# EAGLE design MotoraufsatzschSMD_V2.0 (EAGLE 5.03)
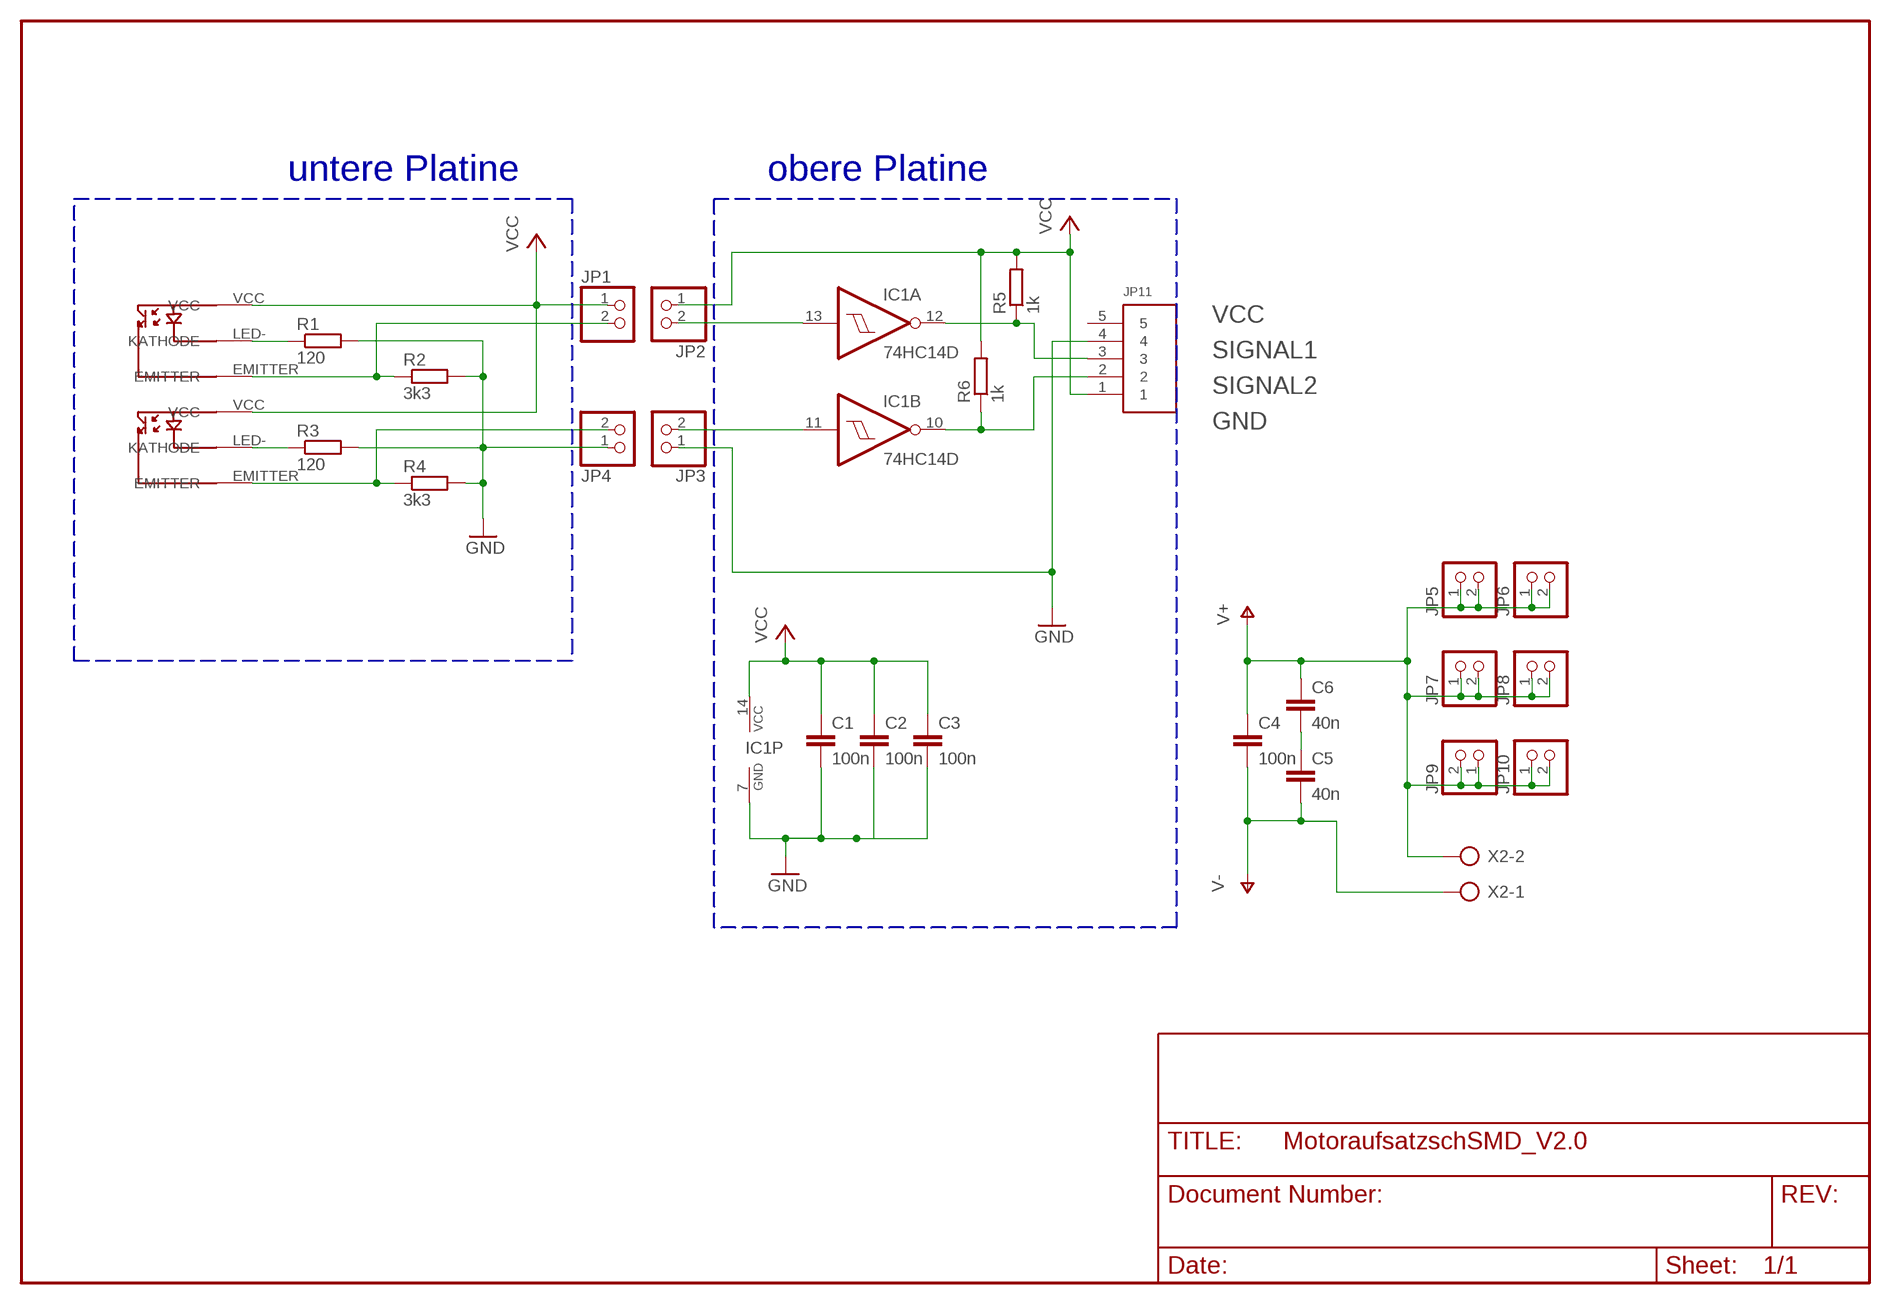
[diagram p0: schematic, sheet 1]

## Parts
C1  100n  C-EUC1206K  [C1206K]
C2  100n  C-EUC1206K  [C1206K]
C3  100n  C-EUC1206K  [C1206K]
C4  100n  C-EU050-024X044  [C050-024X044]
C5  40n  C-EU050-024X044  [C050-024X044]
C6  40n  C-EU050-024X044  [C050-024X044]
IC1  74HC14D  [SO14]
JP1  PINHD-1X2  [1X02]
JP2  PINHD-1X2  [1X02]
JP3  PINHD-1X2  [1X02]
JP4  PINHD-1X2  [1X02]
JP5  PINHD-1X2  [1X02]
JP6  PINHD-1X2  [1X02]
JP7  PINHD-1X2  [1X02]
JP8  PINHD-1X2  [1X02]
JP9  PINHD-1X2  [1X02]
JP10  PINHD-1X2  [1X02]
JP11  5PIN  [B5B-PH-K-S]
R1  120  R-EU_R0805  [R0805]
R2  3k3  R-EU_R0805  [R0805]
R3  120  R-EU_R0805  [R0805]
R4  3k3  R-EU_R0805  [R0805]
R5  1k  R-EU_R0805  [R0805]
R6  1k  R-EU_R0805  [R0805]
U$1  RPI-243-LED-V2  [RPI-243-LED2]
U$2  RPI-243-LED-V2  [RPI-243-LED2]
X2  AK500/2-H  [AK500/2-H]

## Nets
GND: C1.2 C2.2 C3.2 IC1.7(P:GND) JP3.1 JP4.1 JP11.4 R1.2 R2.2 R3.2 R4.2
N$1: C5.1 C6.2
N$3: R3.1 U$2.LED-(KATHODE)
N$4: JP1.2 R2.1 U$1.EMITTER
N$5: JP4.2 R4.1 U$2.EMITTER
N$6: R1.1 U$1.LED-(KATHODE)
N$10: IC1.11(B:I) JP3.2
N$11: IC1.13(A:I) JP2.2
SIGNAL1: IC1.12(A:O) JP11.3 R5.1
SIGNAL2: IC1.10(B:O) JP11.2 R6.1
V+: C4.1 C6.1 JP5.1 JP5.2 JP6.1 JP6.2 JP7.1 JP7.2 JP8.1 JP8.2 JP9.1 JP9.2 JP10.1 JP10.2 X2.2
V-: C4.2 C5.2 X2.1
VCC: C1.1 C2.1 C3.1 IC1.14(P:VCC) JP1.1 JP2.1 JP11.1 R5.2 R6.2 U$1.VCC U$2.VCC
Unconnected: IC1.1(D:I) IC1.2(D:O) IC1.3(E:I) IC1.4(E:O) IC1.5(F:I) IC1.6(F:O) IC1.8(C:O) IC1.9(C:I) JP11.5

## Buses
B$1
B$2

## Notes on the sheet
- untere Platine | obere Platine

## Library data of the parts
C1-C6 = rcl:C-EU: CAPACITOR, European symbol
IC1 = 74xx-eu:74*14: Hex schmitt trigger INVERTER
JP1-JP10 = pinhead:PINHD-1X2: PIN HEADER
JP11 = jst_eph:5PIN
R1-R6 = rcl:R-EU_: RESISTOR, European symbol
U$1 U$2 = olaf:RPI-243-LED-V2
X2 = con-ptr500:AK500/2-H: CONNECTOR Aug. 2004 / PTR Meßtechnik: Die Bezeichnung der Serie AK505 wurde geändert. Es handelt sich hierbei um AK500 in horizontaler Ausführung.

## Board
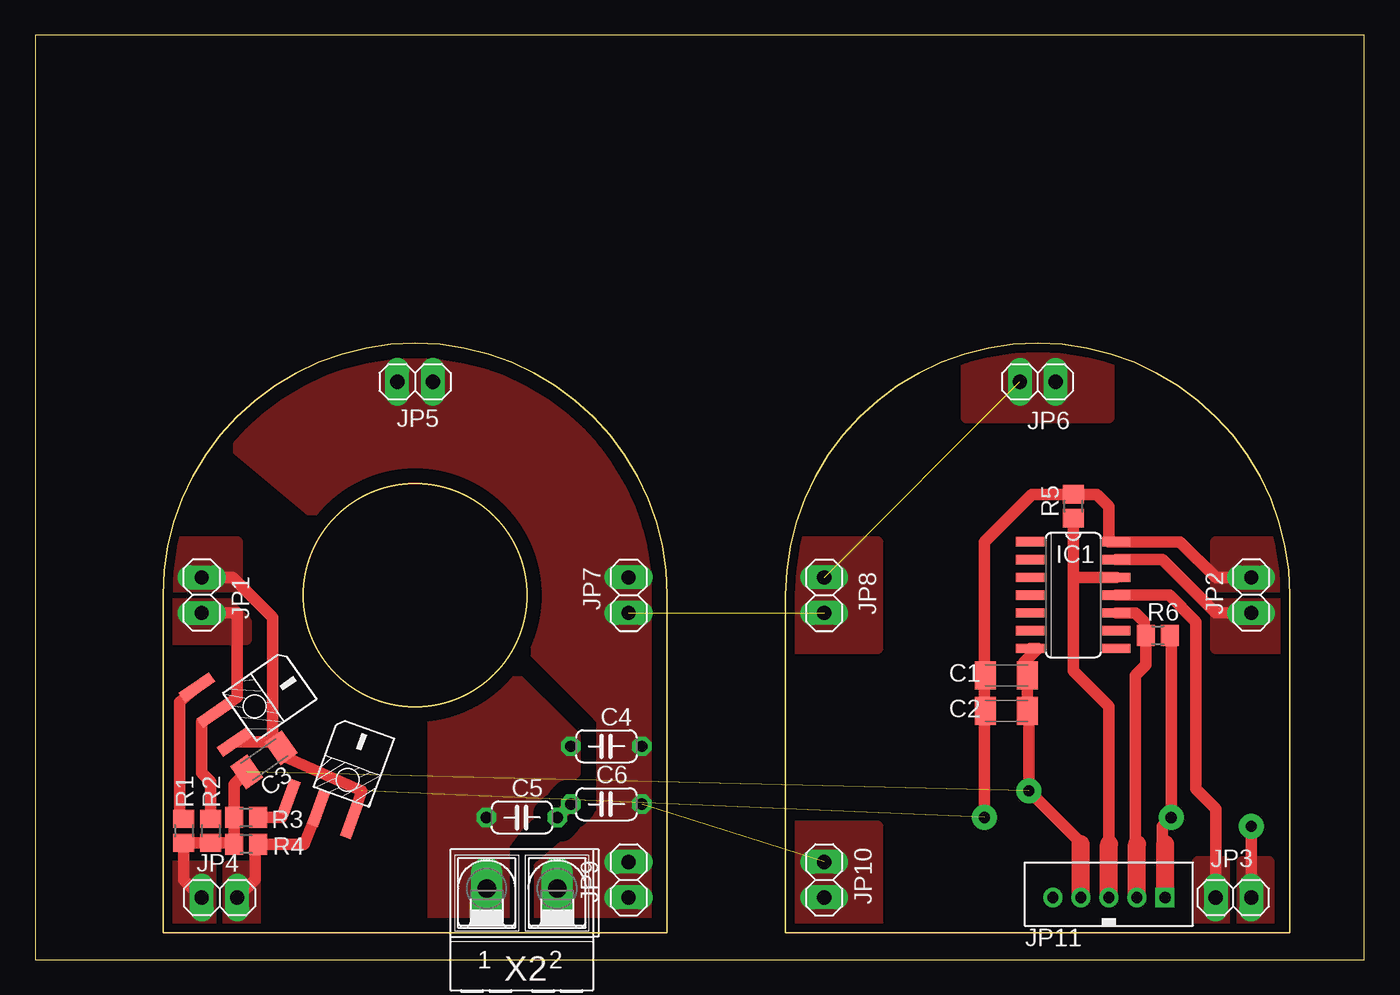
[diagram p1: board, top side]
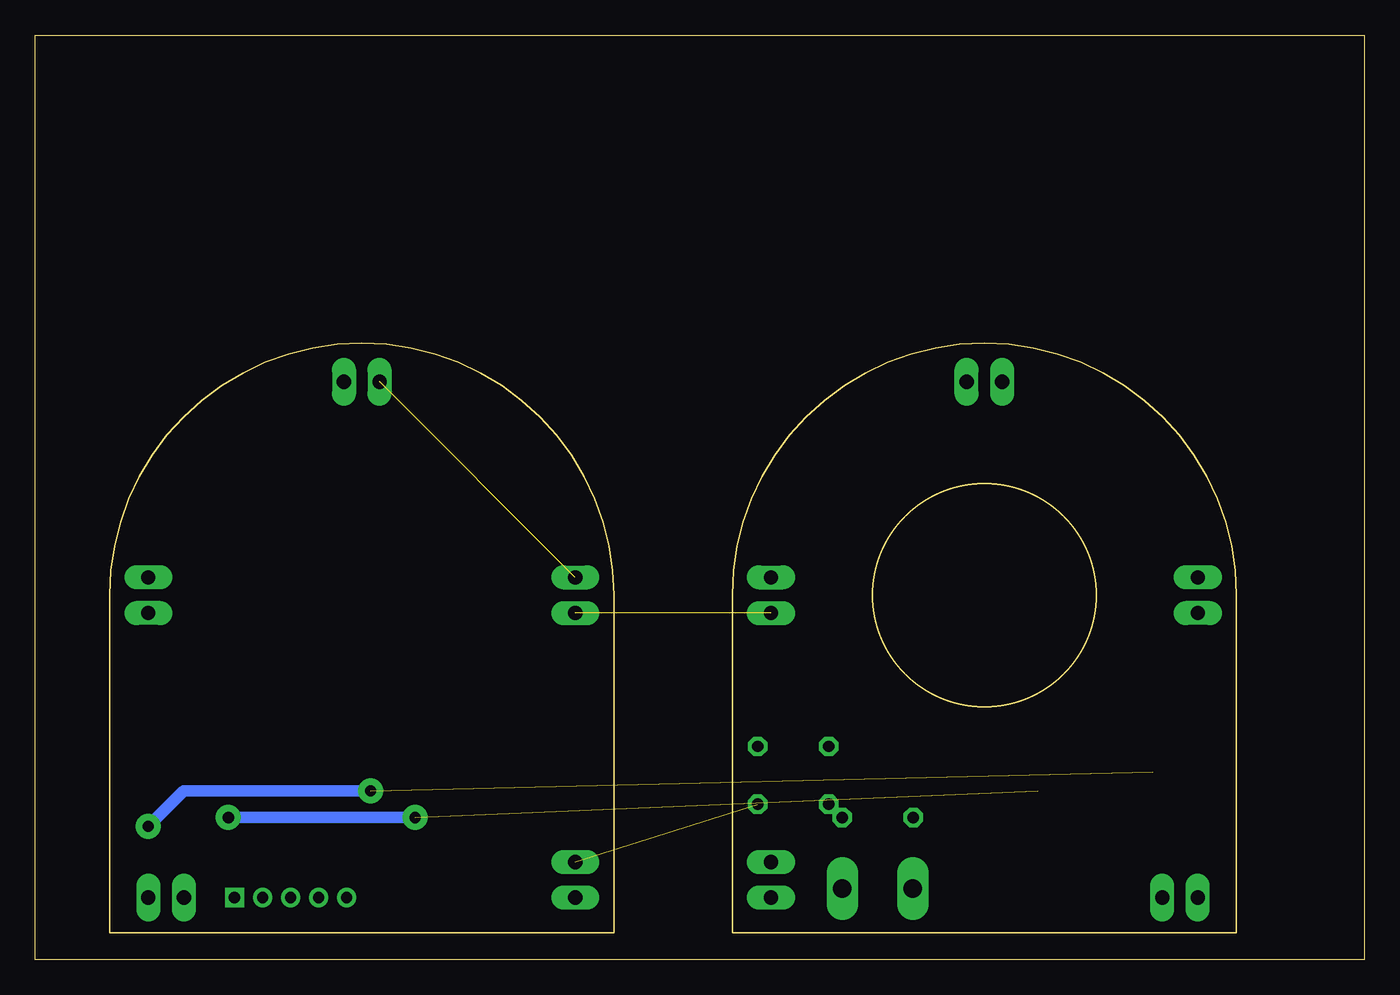
[diagram p2: board, bottom side, seen from below]

Size 94.92 x 66.03 mm. Coordinates in mm from the lower left corner, seen from the top.
Outline: 0,0 94.92,0 94.92,66.03 0,66.03 0,0
Outline: 89.59,26.03 arc180 53.59,26.03 53.59,1.9 89.59,1.9 89.59,26.03
Outline: 9.14,26.03 arc-180 45.14,26.03 45.14,1.9 9.14,1.9 9.14,26.03
Outline: circle at 27.14,26.03 radius 7.97
Copper layers (1*16): Top 0.035mm / dielectric 1.5mm / Bottom 0.035mm
Design rules "default *": minimum track width 32mil, minimum drill 24mil, track to track 16mil, track to pad 16mil, pad to pad 16mil, via to via 16mil, smd to smd 16mil, copper to edge 24mil, drill to drill 8mil, minimum pad ring 10mil, minimum via ring 8mil, stop-mask expansion 4mil, vias tented up to drill 0mil, thermal gap 10mil

### Footprints (pad centres in the part's own frame; a part is rotated, then mirrored left to right if it is on the bottom)
C1206K = smd 1.5 x 2: 1 -1.5,0; 2 1.5,0
C050-024X044 = drill 0.813 octagon: 1 -2.54,0; 2 2.54,0
SO14 = smd 0.66 x 2.032: 1 -3.81,-3.073; 2 -2.54,-3.073; 3 -1.27,-3.073; 4 0,-3.073; 5 1.27,-3.073; 6 2.54,-3.073; 7 3.81,-3.073; 8 3.81,3.073; 9 2.54,3.073; 10 1.27,3.073; 11 0,3.073; 12 -1.27,3.073; 13 -2.54,3.073; 14 -3.81,3.073
1X02 = drill 1.016 long: 1 -1.27,0; 2 1.27,0
B5B-PH-K-S = drill 0.813 square: 1 4,0 | drill 0.813 round: 2 2,0; 3 0,0; 4 -2,0; 5 -4,0
R0805 = smd 1.3 x 1.5: 1 -0.85,0; 2 0.85,0
RPI-243-LED2 = smd 0.8 x 2.6: EMITTER -1.25,-6.5; LED- -3.5,-6.5; VCC 1.25,-6.5
AK500/2-H = drill 1.321 long: 1 -2.515,0; 2 2.515,0

### Placement (x,y rotation side)
C1  69.37,20.31 0 top
C2  69.37,17.77 0 top
C3  16.34,14.28 215 top
C4  40.79,15.24 180 top
C5  34.76,10.16 180 top
C6  40.79,11.11 180 top
IC1  74.13,26.03 270 top
JP1  11.9,26.03 270 top
JP2  86.83,26.03 270 top
JP3  85.56,4.44 180 top
JP4  13.17,4.44 0 top
JP5  27.14,41.27 0 top
JP6  71.59,41.27 180 top
JP7  42.38,26.03 90 top
JP8  56.35,26.03 90 top
JP9  42.38,5.71 90 top
JP10  56.35,5.71 90 top
JP11  76.67,4.44 0 top
R1  10.63,9.2 270 top
R2  12.54,9.2 270 top
R3  15.08,10.16 180 top
R4  15.08,8.25 180 top
R5  74.13,32.38 90 top
R6  80.16,23.17 0 top
U$1  18.88,20.31 305 top
U$2  23.65,16.5 340 top
X2  34.76,5.08 0 top

### Tracks (layer width: path | path; a pad name or v marks a point on that pad's centre or on a via)
GND  (via drill 0.8 pad 1.78)  (1 unrouted)
  Top 0.813: JP4.1 10.63,5.71 R1.2 R2.2 14.12,8.35 R4.2 R3.2 14.23,12.53 C3.2 | v86.83,9.52 JP3.1 | IC1.7 71.59,22.22 70.55,21.18 C1.2 C2.2 70.95,17.69 v70.95,12.06 74.67,8.35 74.67,8.25
  Top 1.27: JP11.4 74.67,8.25
  Bottom 0.813: v86.83,9.52 84.29,12.06 v70.95,12.06
  pour Top (no thermals): 86.19,6.98 88.1,6.98 88.1,1.9 86.19,1.9
  pour Top (no thermals): 9.36,1.9 9.36,6.66 12.54,6.66 12.54,1.9
N$1
  Top 0.813: C5.1 C6.2
N$3
  Top 0.813: U$2.LED- 17.61,10.16 R3.1
N$4
  Top 0.813: JP1.2 14.44,24.76 14.44,18.73 U$1.EMITTER 11.9,16.98 11.9,13.33 12.54,12.7 R2.1
  pour Top (no thermals): 9.36,22.86 9.36,25.39 13.81,25.39 15.08,24.12 15.08,22.86
N$5
  Top 0.813: U$2.EMITTER 19.2,8.25 R4.1 15.71,7.93 15.71,5.71 JP4.2
  pour Top (no thermals): 15.71,1.9 13.81,1.9 13.81,6.66 15.71,6.66
N$6
  Top 0.813: U$1.LED- 10.31,18.41 10.31,10.47 R1.1
N$10
  Top 0.813: IC1.11 80.99,26.03 82.89,24.12 82.89,12.19 84.29,10.79 JP3.2
  pour Top (no thermals): 83.02,1.9 84.92,1.9 84.92,6.98 83.02,6.98
N$11
  Top 0.813: JP2.2 84.29,24.76 80.48,28.57 IC1.13
  pour Top (no thermals): 89.37,22.22 89.37,25.39 84.29,25.39 84.29,22.22
SIGNAL1
  Top 0.813: 76.67,8.25 76.67,18.09 74.13,20.63 74.13,27.3 | 74.13,27.3 R5.1 | 74.13,27.3 IC1.12
  Top 1.27: JP11.3 76.67,8.25
SIGNAL2
  Top 0.813: IC1.10 78.58,24.76 79.21,24.12 79.21,23.27 R6.1 79.31,21.05 78.58,20.31 78.58,8.35 78.67,8.25
  Top 1.27: JP11.2 78.67,8.25
V+  (3 unrouted)
  pour Top (isolate 1.016, rank 2, no thermals): 44.92,1.9 36.03,1.9 36.03,6.66 40.48,10.47 40.48,17.14 34.76,22.86 34.76,28.57 32.22,32.38 27.14,33.97 23.33,33.02 21.42,31.74 20.79,31.11 13.17,37.46 18.25,42.54 24.6,43.81 30.95,43.81 37.3,41.27 41.11,37.46 43.65,33.65 44.92,28.57
  pour Top (no thermals): 53.81,29.84 60.16,29.84 60.16,22.22 53.81,22.22
  pour Top (no thermals): 53.81,9.52 60.16,9.52 60.16,1.9 53.81,1.9
  pour Top (no thermals): 66.51,43.81 66.51,38.73 76.67,38.73 76.67,43.81
V-
  pour Top (isolate 1.016, no thermals): 28.41,18.41 28.41,1.9 33.49,1.9 33.49,8.25 34.44,9.52 38.57,13.33 38.57,15.91 33.49,20.95 arc-48
VCC  (via drill 0.8 pad 1.78)  (1 unrouted)
  Top 0.813: JP1.1 14.12,27.3 16.98,24.44 16.98,16.05 C3.1 | U$1.VCC 17.15,15.56 C3.1 | U$2.VCC 23.33,12.06 17.61,14.6 C3.1 | JP2.1 84.29,27.3 81.75,29.84 IC1.14 76.67,29.84 76.67,32.38 75.82,33.23 R5.2 71.17,33.23 67.78,29.84 67.78,20.4 C1.1 67.78,20.23 67.78,17.69 | 80.67,8.25 80.48,8.44 80.48,9.52 v81.11,10.16 81.11,23.07 R6.2 | v67.78,10.16 67.78,17.69 | 67.78,17.69 C2.1
  Top 1.27: 80.67,8.25 JP11.1
  Bottom 0.813: v67.78,10.16 v81.11,10.16
  pour Top (no thermals): 89.37,29.84 89.37,26.66 84.29,26.66 84.29,29.84
  pour Top (no thermals): 9.36,29.84 9.36,26.66 14.44,26.66 14.44,29.84

### Text on the board
Measures: 55° | 20°
Document: Ausßenkontur 36mm | Schlitzscheibe 25mm | Lager 16mm | GND | GND | SIGNAL_A | SIGNAL_B | VCC